# EAGLE schematic Negibus (EAGLE 6.6.0)

## Sheet 1 of 4
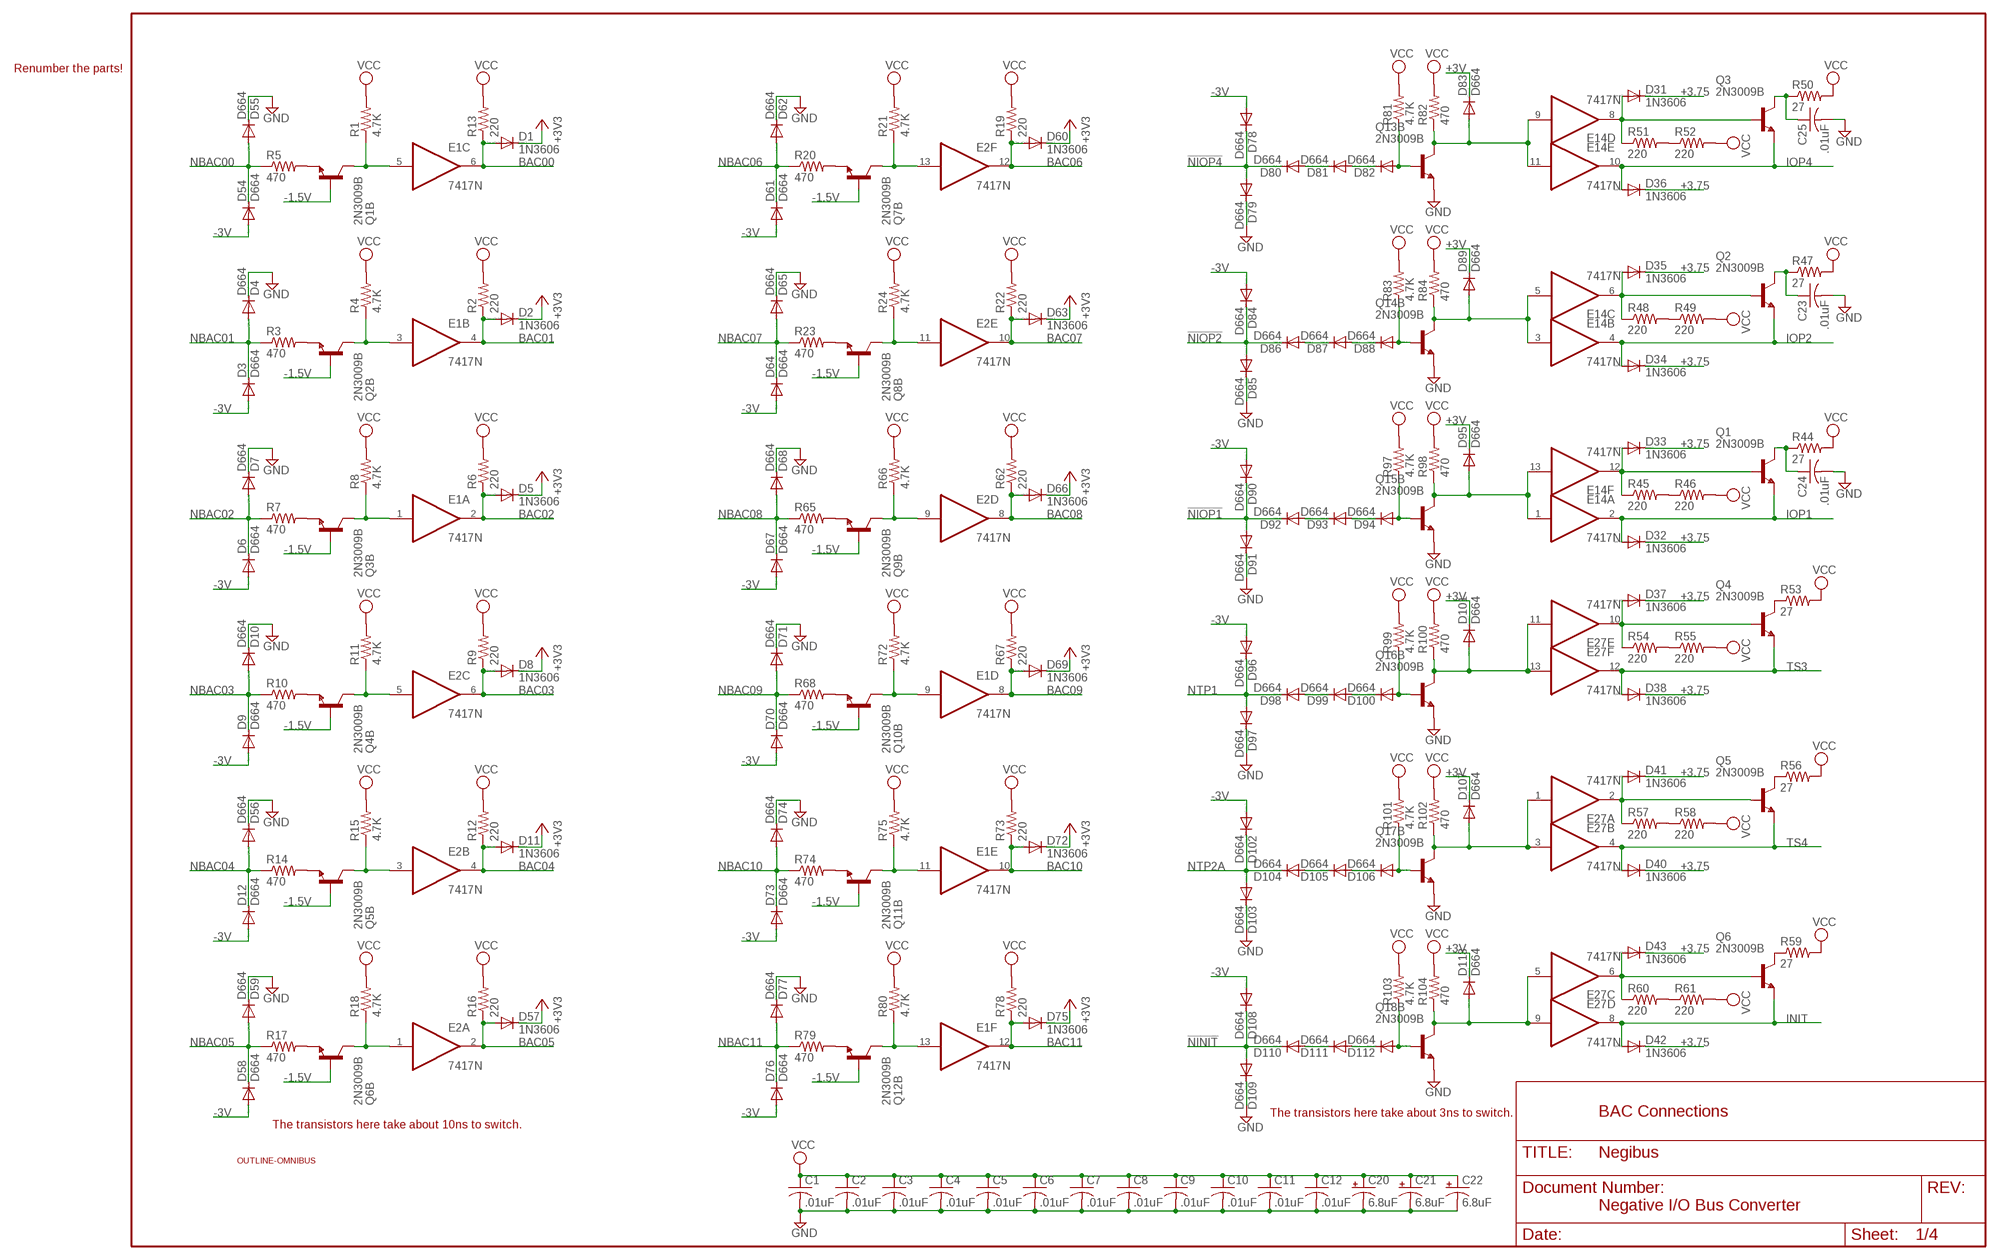
[diagram p0: schematic, sheet 1]

### Parts
C1  .01uF  C-US050-025X075  [C050-025X075]
C2  .01uF  C-US050-025X075  [C050-025X075]
C3  .01uF  C-US050-025X075  [C050-025X075]
C4  .01uF  C-US050-025X075  [C050-025X075]
C5  .01uF  C-US050-025X075  [C050-025X075]
C6  .01uF  C-US050-025X075  [C050-025X075]
C7  .01uF  C-US050-025X075  [C050-025X075]
C8  .01uF  C-US050-025X075  [C050-025X075]
C9  .01uF  C-US050-025X075  [C050-025X075]
C10  .01uF  C-US050-025X075  [C050-025X075]
C11  .01uF  C-US050-025X075  [C050-025X075]
C12  .01uF  C-US050-025X075  [C050-025X075]
C20  6.8uF  CPOL-USE20-8AXIAL  [E12-8]
C21  6.8uF  CPOL-USE20-8AXIAL  [E12-8]
C22  6.8uF  CPOL-USE20-8AXIAL  [E12-8]
C23  .01uF  C-US050-025X075  [C050-025X075]
C24  .01uF  C-US050-025X075  [C050-025X075]
C25  .01uF  C-US050-025X075  [C050-025X075]
D1  1N3606  DIODE-DO35-10  [DO35-10]
D2  1N3606  DIODE-DO35-10  [DO35-10]
D3  D664  1N4148DO35-10  [DO35-10]
D4  D664  1N4148DO35-10  [DO35-10]
D5  1N3606  DIODE-DO35-10  [DO35-10]
D6  D664  1N4148DO35-10  [DO35-10]
D7  D664  1N4148DO35-10  [DO35-10]
D8  1N3606  DIODE-DO35-10  [DO35-10]
D9  D664  1N4148DO35-10  [DO35-10]
D10  D664  1N4148DO35-10  [DO35-10]
D11  1N3606  DIODE-DO35-10  [DO35-10]
D12  D664  1N4148DO35-10  [DO35-10]
D31  1N3606  DIODE-DO35-10  [DO35-10]
D32  1N3606  DIODE-DO35-10  [DO35-10]
D33  1N3606  DIODE-DO35-10  [DO35-10]
D34  1N3606  DIODE-DO35-10  [DO35-10]
D35  1N3606  DIODE-DO35-10  [DO35-10]
D36  1N3606  DIODE-DO35-10  [DO35-10]
D37  1N3606  DIODE-DO35-10  [DO35-10]
D38  1N3606  DIODE-DO35-10  [DO35-10]
D40  1N3606  DIODE-DO35-10  [DO35-10]
D41  1N3606  DIODE-DO35-10  [DO35-10]
D42  1N3606  DIODE-DO35-10  [DO35-10]
D43  1N3606  DIODE-DO35-10  [DO35-10]
D54  D664  1N4148DO35-10  [DO35-10]
D55  D664  1N4148DO35-10  [DO35-10]
D56  D664  1N4148DO35-10  [DO35-10]
D57  1N3606  DIODE-DO35-10  [DO35-10]
D58  D664  1N4148DO35-10  [DO35-10]
D59  D664  1N4148DO35-10  [DO35-10]
D60  1N3606  DIODE-DO35-10  [DO35-10]
D61  D664  1N4148DO35-10  [DO35-10]
D62  D664  1N4148DO35-10  [DO35-10]
D63  1N3606  DIODE-DO35-10  [DO35-10]
D64  D664  1N4148DO35-10  [DO35-10]
D65  D664  1N4148DO35-10  [DO35-10]
D66  1N3606  DIODE-DO35-10  [DO35-10]
D67  D664  1N4148DO35-10  [DO35-10]
D68  D664  1N4148DO35-10  [DO35-10]
D69  1N3606  DIODE-DO35-10  [DO35-10]
D70  D664  1N4148DO35-10  [DO35-10]
D71  D664  1N4148DO35-10  [DO35-10]
D72  1N3606  DIODE-DO35-10  [DO35-10]
D73  D664  1N4148DO35-10  [DO35-10]
D74  D664  1N4148DO35-10  [DO35-10]
D75  1N3606  DIODE-DO35-10  [DO35-10]
D76  D664  1N4148DO35-10  [DO35-10]
D77  D664  1N4148DO35-10  [DO35-10]
D78  D664  1N4148DO35-10  [DO35-10]
D79  D664  1N4148DO35-10  [DO35-10]
D80  D664  1N4148DO35-10  [DO35-10]
D81  D664  1N4148DO35-10  [DO35-10]
D82  D664  1N4148DO35-10  [DO35-10]
D83  D664  1N4148DO35-10  [DO35-10]
D84  D664  1N4148DO35-10  [DO35-10]
D85  D664  1N4148DO35-10  [DO35-10]
D86  D664  1N4148DO35-10  [DO35-10]
D87  D664  1N4148DO35-10  [DO35-10]
D88  D664  1N4148DO35-10  [DO35-10]
D89  D664  1N4148DO35-10  [DO35-10]
D90  D664  1N4148DO35-10  [DO35-10]
D91  D664  1N4148DO35-10  [DO35-10]
D92  D664  1N4148DO35-10  [DO35-10]
D93  D664  1N4148DO35-10  [DO35-10]
D94  D664  1N4148DO35-10  [DO35-10]
D95  D664  1N4148DO35-10  [DO35-10]
D96  D664  1N4148DO35-10  [DO35-10]
D97  D664  1N4148DO35-10  [DO35-10]
D98  D664  1N4148DO35-10  [DO35-10]
D99  D664  1N4148DO35-10  [DO35-10]
D100  D664  1N4148DO35-10  [DO35-10]
D101  D664  1N4148DO35-10  [DO35-10]
D102  D664  1N4148DO35-10  [DO35-10]
D103  D664  1N4148DO35-10  [DO35-10]
D104  D664  1N4148DO35-10  [DO35-10]
D105  D664  1N4148DO35-10  [DO35-10]
D106  D664  1N4148DO35-10  [DO35-10]
D107  D664  1N4148DO35-10  [DO35-10]
D108  D664  1N4148DO35-10  [DO35-10]
D109  D664  1N4148DO35-10  [DO35-10]
D110  D664  1N4148DO35-10  [DO35-10]
D111  D664  1N4148DO35-10  [DO35-10]
D112  D664  1N4148DO35-10  [DO35-10]
D113  D664  1N4148DO35-10  [DO35-10]
E1  7417N  7407N  [DIL14]
E2  7417N  7407N  [DIL14]
E14  7417N  7407N  [DIL14]
E27  7417N  7407N  [DIL14]
Q1  2N3009B  -NPN-TO5  [TO5]
Q1B  2N3009B  2N3019  [TO39]
Q2  2N3009B  -NPN-TO5  [TO5]
Q2B  2N3009B  2N3019  [TO39]
Q3  2N3009B  -NPN-TO5  [TO5]
Q3B  2N3009B  2N3019  [TO39]
Q4  2N3009B  -NPN-TO5  [TO5]
Q4B  2N3009B  2N3019  [TO39]
Q5  2N3009B  -NPN-TO5  [TO5]
Q5B  2N3009B  2N3019  [TO39]
Q6  2N3009B  -NPN-TO5  [TO5]
Q6B  2N3009B  2N3019  [TO39]
Q7B  2N3009B  2N3019  [TO39]
Q8B  2N3009B  2N3019  [TO39]
Q9B  2N3009B  2N3019  [TO39]
Q10B  2N3009B  2N3019  [TO39]
Q11B  2N3009B  2N3019  [TO39]
Q12B  2N3009B  2N3019  [TO39]
Q13B  2N3009B  2N3019  [TO39]
Q14B  2N3009B  2N3019  [TO39]
Q15B  2N3009B  2N3019  [TO39]
Q16B  2N3009B  2N3019  [TO39]
Q17B  2N3009B  2N3019  [TO39]
Q18B  2N3009B  2N3019  [TO39]
R1  4.7K  R-US_0207/10  [0207/10]
R2  220  R-US_0207/10  [0207/10]
R3  470  R-US_0207/10  [0207/10]
R4  4.7K  R-US_0207/10  [0207/10]
R5  470  R-US_0207/10  [0207/10]
R6  220  R-US_0207/10  [0207/10]
R7  470  R-US_0207/10  [0207/10]
R8  4.7K  R-US_0207/10  [0207/10]
R9  220  R-US_0207/10  [0207/10]
R10  470  R-US_0207/10  [0207/10]
R11  4.7K  R-US_0207/10  [0207/10]
R12  220  R-US_0207/10  [0207/10]
R13  220  R-US_0207/10  [0207/10]
R14  470  R-US_0207/10  [0207/10]
R15  4.7K  R-US_0207/10  [0207/10]
R16  220  R-US_0207/10  [0207/10]
R17  470  R-US_0207/10  [0207/10]
R18  4.7K  R-US_0207/10  [0207/10]
R19  220  R-US_0207/10  [0207/10]
R20  470  R-US_0207/10  [0207/10]
R21  4.7K  R-US_0207/10  [0207/10]
R22  220  R-US_0207/10  [0207/10]
R23  470  R-US_0207/10  [0207/10]
R24  4.7K  R-US_0207/10  [0207/10]
R44  27  R-US_0411/12  [0411/12]
R45  220  R-US_0207/10  [0207/10]
R46  220  R-US_0207/10  [0207/10]
R47  27  R-US_0411/12  [0411/12]
R48  220  R-US_0207/10  [0207/10]
R49  220  R-US_0207/10  [0207/10]
R50  27  R-US_0411/12  [0411/12]
R51  220  R-US_0207/10  [0207/10]
R52  220  R-US_0207/10  [0207/10]
R53  27  R-US_0411/12  [0411/12]
R54  220  R-US_0207/10  [0207/10]
R55  220  R-US_0207/10  [0207/10]
R56  27  R-US_0411/12  [0411/12]
R57  220  R-US_0207/10  [0207/10]
R58  220  R-US_0207/10  [0207/10]
R59  27  R-US_0411/12  [0411/12]
R60  220  R-US_0207/10  [0207/10]
R61  220  R-US_0207/10  [0207/10]
R62  220  R-US_0207/10  [0207/10]
R65  470  R-US_0207/10  [0207/10]
R66  4.7K  R-US_0207/10  [0207/10]
R67  220  R-US_0207/10  [0207/10]
R68  470  R-US_0207/10  [0207/10]
R72  4.7K  R-US_0207/10  [0207/10]
R73  220  R-US_0207/10  [0207/10]
R74  470  R-US_0207/10  [0207/10]
R75  4.7K  R-US_0207/10  [0207/10]
R78  220  R-US_0207/10  [0207/10]
R79  470  R-US_0207/10  [0207/10]
R80  4.7K  R-US_0207/10  [0207/10]
R81  4.7K  R-US_0207/10  [0207/10]
R82  470  R-US_0207/10  [0207/10]
R83  4.7K  R-US_0207/10  [0207/10]
R84  470  R-US_0207/10  [0207/10]
R97  4.7K  R-US_0207/10  [0207/10]
R98  470  R-US_0207/10  [0207/10]
R99  4.7K  R-US_0207/10  [0207/10]
R100  470  R-US_0207/10  [0207/10]
R101  4.7K  R-US_0207/10  [0207/10]
R102  470  R-US_0207/10  [0207/10]
R103  4.7K  R-US_0207/10  [0207/10]
R104  470  R-US_0207/10  [0207/10]
U$1  OUTLINE-OMNIBUS  [OMNIBUS]

### Nets
!NINIT: D108.C D109.A D110.C ; also sheet 4
!NIOP1: D90.C D91.A D92.C ; also sheet 4
!NIOP2: D84.C D85.A D86.C ; also sheet 4
!NIOP4: D78.C D79.A D80.C ; also sheet 4
+3.75: D31.C D32.C D33.C D34.C D35.C D36.C D37.C D38.C D40.C D41.C D42.C D43.C ; also sheet 2
+3V [power]: D83.C D89.C D95.C D101.C D107.C D113.C
+3V3: D1.C D2.C D5.C D8.C D11.C D57.C D60.C D63.C D66.C D69.C D72.C D75.C ; also sheet 2
-1.5V [power]: Q1B.2(B) Q2B.2(B) Q3B.2(B) Q4B.2(B) Q5B.2(B) Q6B.2(B) Q7B.2(B) Q8B.2(B) Q9B.2(B) Q10B.2(B) Q11B.2(B) Q12B.2(B) ; also sheet 2
-3V [power]: D3.A D6.A D9.A D12.A D54.A D58.A D61.A D64.A D67.A D70.A D73.A D76.A D78.A D84.A D90.A D96.A D102.A D108.A ; also sheet 2,3
BAC00: D1.A E1.6(C:O) R13.1 ; also sheet 4
BAC01: D2.A E1.4(B:O) R2.1 ; also sheet 4
BAC02: D5.A E1.2(A:O) R6.1 ; also sheet 4
BAC03: D8.A E2.6(C:O) R9.1 ; also sheet 4
BAC04: D11.A E2.4(B:O) R12.1 ; also sheet 4
BAC05: D57.A E2.2(A:O) R16.1 ; also sheet 4
BAC06: D60.A E2.12(F:O) R19.1 ; also sheet 4
BAC07: D63.A E2.10(E:O) R22.1 ; also sheet 4
BAC08: D66.A E2.8(D:O) R62.1 ; also sheet 4
BAC09: D69.A E1.8(D:O) R67.1 ; also sheet 4
BAC10: D72.A E1.10(E:O) R73.1 ; also sheet 4
BAC11: D75.A E1.12(F:O) R78.1 ; also sheet 4
GND: C1.2 C2.2 C3.2 C4.2 C5.2 C6.2 C7.2 C8.2 C9.2 C10.2 C11.2 C12.2 C20.- C21.- C22.- C23.2 C24.2 C25.2 D4.C D7.C D10.C D55.C D56.C D59.C D62.C D65.C D68.C D71.C D74.C D77.C D79.C D85.C D91.C D97.C D103.C D109.C Q13B.1(E) Q14B.1(E) Q15B.1(E) Q16B.1(E) Q17B.1(E) Q18B.1(E) ; also sheet 2,3,4
INIT: D42.A E27.8(D:O) Q6.1(E) ; also sheet 4
IOP1: D32.A E14.2(A:O) Q1.1(E) ; also sheet 4
IOP2: D34.A E14.4(B:O) Q2.1(E) ; also sheet 4
IOP4: D36.A E14.10(E:O) Q3.1(E) ; also sheet 4
N$1: Q2B.1(E) R3.2
N$5: D89.A E14.3(B:I) E14.5(C:I) Q14B.3(C) R84.1
N$8: Q1B.1(E) R5.2
N$9: E1.5(C:I) Q1B.3(C) R1.1
N$10: E1.3(B:I) Q2B.3(C) R4.1
N$11: Q3B.1(E) R7.2
N$12: E1.1(A:I) Q3B.3(C) R8.1
N$13: Q4B.1(E) R10.2
N$14: E2.5(C:I) Q4B.3(C) R11.1
N$15: Q5B.1(E) R14.2
N$16: E2.3(B:I) Q5B.3(C) R15.1
N$17: Q6B.1(E) R17.2
N$18: E2.1(A:I) Q6B.3(C) R18.1
N$19: Q7B.1(E) R20.2
N$20: E2.13(F:I) Q7B.3(C) R21.1
N$21: Q8B.1(E) R23.2
N$22: E2.11(E:I) Q8B.3(C) R24.1
N$23: Q9B.1(E) R65.2
N$24: E2.9(D:I) Q9B.3(C) R66.1
N$25: Q10B.1(E) R68.2
N$26: E1.9(D:I) Q10B.3(C) R72.1
N$27: Q11B.1(E) R74.2
N$28: E1.11(E:I) Q11B.3(C) R75.1
N$29: Q12B.1(E) R79.2
N$30: E1.13(F:I) Q12B.3(C) R80.1
N$32: D82.A Q13B.2(B) R81.1
N$33: D80.A D81.C
N$35: D88.A Q14B.2(B) R83.1
N$36: D86.A D87.C
N$37: D87.A D88.C
N$47: D94.A Q15B.2(B) R97.1
N$52: R54.2 R55.1
N$53: D92.A D93.C
N$54: D101.A E27.11(E:I) E27.13(F:I) Q16B.3(C) R100.1
N$55: D37.A E27.10(E:O) Q4.2(B) R54.1
N$56: Q4.3(C) R53.1
N$57: D93.A D94.C
N$58: D41.A E27.2(A:O) Q5.2(B) R57.1
N$59: D95.A E14.1(A:I) E14.13(F:I) Q15B.3(C) R98.1
N$60: D107.A E27.1(A:I) E27.3(B:I) Q17B.3(C) R102.1
N$61: R57.2 R58.1
N$63: Q5.3(C) R56.1
N$64: D100.A Q16B.2(B) R99.1
N$65: D98.A D99.C
N$66: D113.A E27.5(C:I) E27.9(D:I) Q18B.3(C) R104.1
N$67: R60.2 R61.1
N$68: D43.A E27.6(C:O) Q6.2(B) R60.1
N$69: Q6.3(C) R59.1
N$70: D99.A D100.C
N$73: D81.A D82.C
N$74: D83.A E14.9(D:I) E14.11(E:I) Q13B.3(C) R82.1
N$75: D106.A Q17B.2(B) R101.1
N$76: D104.A D105.C
N$77: D105.A D106.C
N$80: D112.A Q18B.2(B) R103.1
N$81: D110.A D111.C
N$82: D111.A D112.C
N$108: D35.A E14.6(C:O) Q2.2(B) R48.1
N$109: D33.A E14.12(F:O) Q1.2(B) R45.1
N$110: R48.2 R49.1
N$111: R51.2 R52.1
N$112: D31.A E14.8(D:O) Q3.2(B) R51.1
N$113: C25.1 Q3.3(C) R50.1
N$116: C23.1 Q2.3(C) R47.1
N$118: C24.1 Q1.3(C) R44.1
N$119: R45.2 R46.1
NBAC00: D54.C D55.A R5.1 ; also sheet 4
NBAC01: D3.C D4.A R3.1 ; also sheet 4
NBAC02: D6.C D7.A R7.1 ; also sheet 4
NBAC03: D9.C D10.A R10.1 ; also sheet 4
NBAC04: D12.C D56.A R14.1 ; also sheet 4
NBAC05: D58.C D59.A R17.1 ; also sheet 4
NBAC06: D61.C D62.A R20.1 ; also sheet 4
NBAC07: D64.C D65.A R23.1 ; also sheet 4
NBAC08: D67.C D68.A R65.1 ; also sheet 4
NBAC09: D70.C D71.A R68.1 ; also sheet 4
NBAC10: D73.C D74.A R74.1 ; also sheet 4
NBAC11: D76.C D77.A R79.1 ; also sheet 4
NTP1: D96.C D97.A D98.C ; also sheet 4
NTP2A: D102.C D103.A D104.C ; also sheet 4
TS3: D38.A E27.12(F:O) Q4.1(E) ; also sheet 4
TS4: D40.A E27.4(B:O) Q5.1(E) ; also sheet 4
VCC: C1.1 C2.1 C3.1 C4.1 C5.1 C6.1 C7.1 C8.1 C9.1 C10.1 C11.1 C12.1 C20.+ C21.+ C22.+ R1.2 R2.2 R4.2 R6.2 R8.2 R9.2 R11.2 R12.2 R13.2 R15.2 R16.2 R18.2 R19.2 R21.2 R22.2 R24.2 R44.2 R46.2 R47.2 R49.2 R50.2 R52.2 R53.2 R55.2 R56.2 R58.2 R59.2 R61.2 R62.2 R66.2 R67.2 R72.2 R73.2 R75.2 R78.2 R80.2 R81.2 R82.2 R83.2 R84.2 R97.2 R98.2 R99.2 R100.2 R101.2 R102.2 R103.2 R104.2 ; also sheet 2,3,4

### Notes on the sheet
- Renumber the parts!
- The transistors here take about 3ns to switch. | BAC Connections
- The transistors here take about 10ns to switch.
- Negative I/O Bus Converter

## Sheet 2 of 4
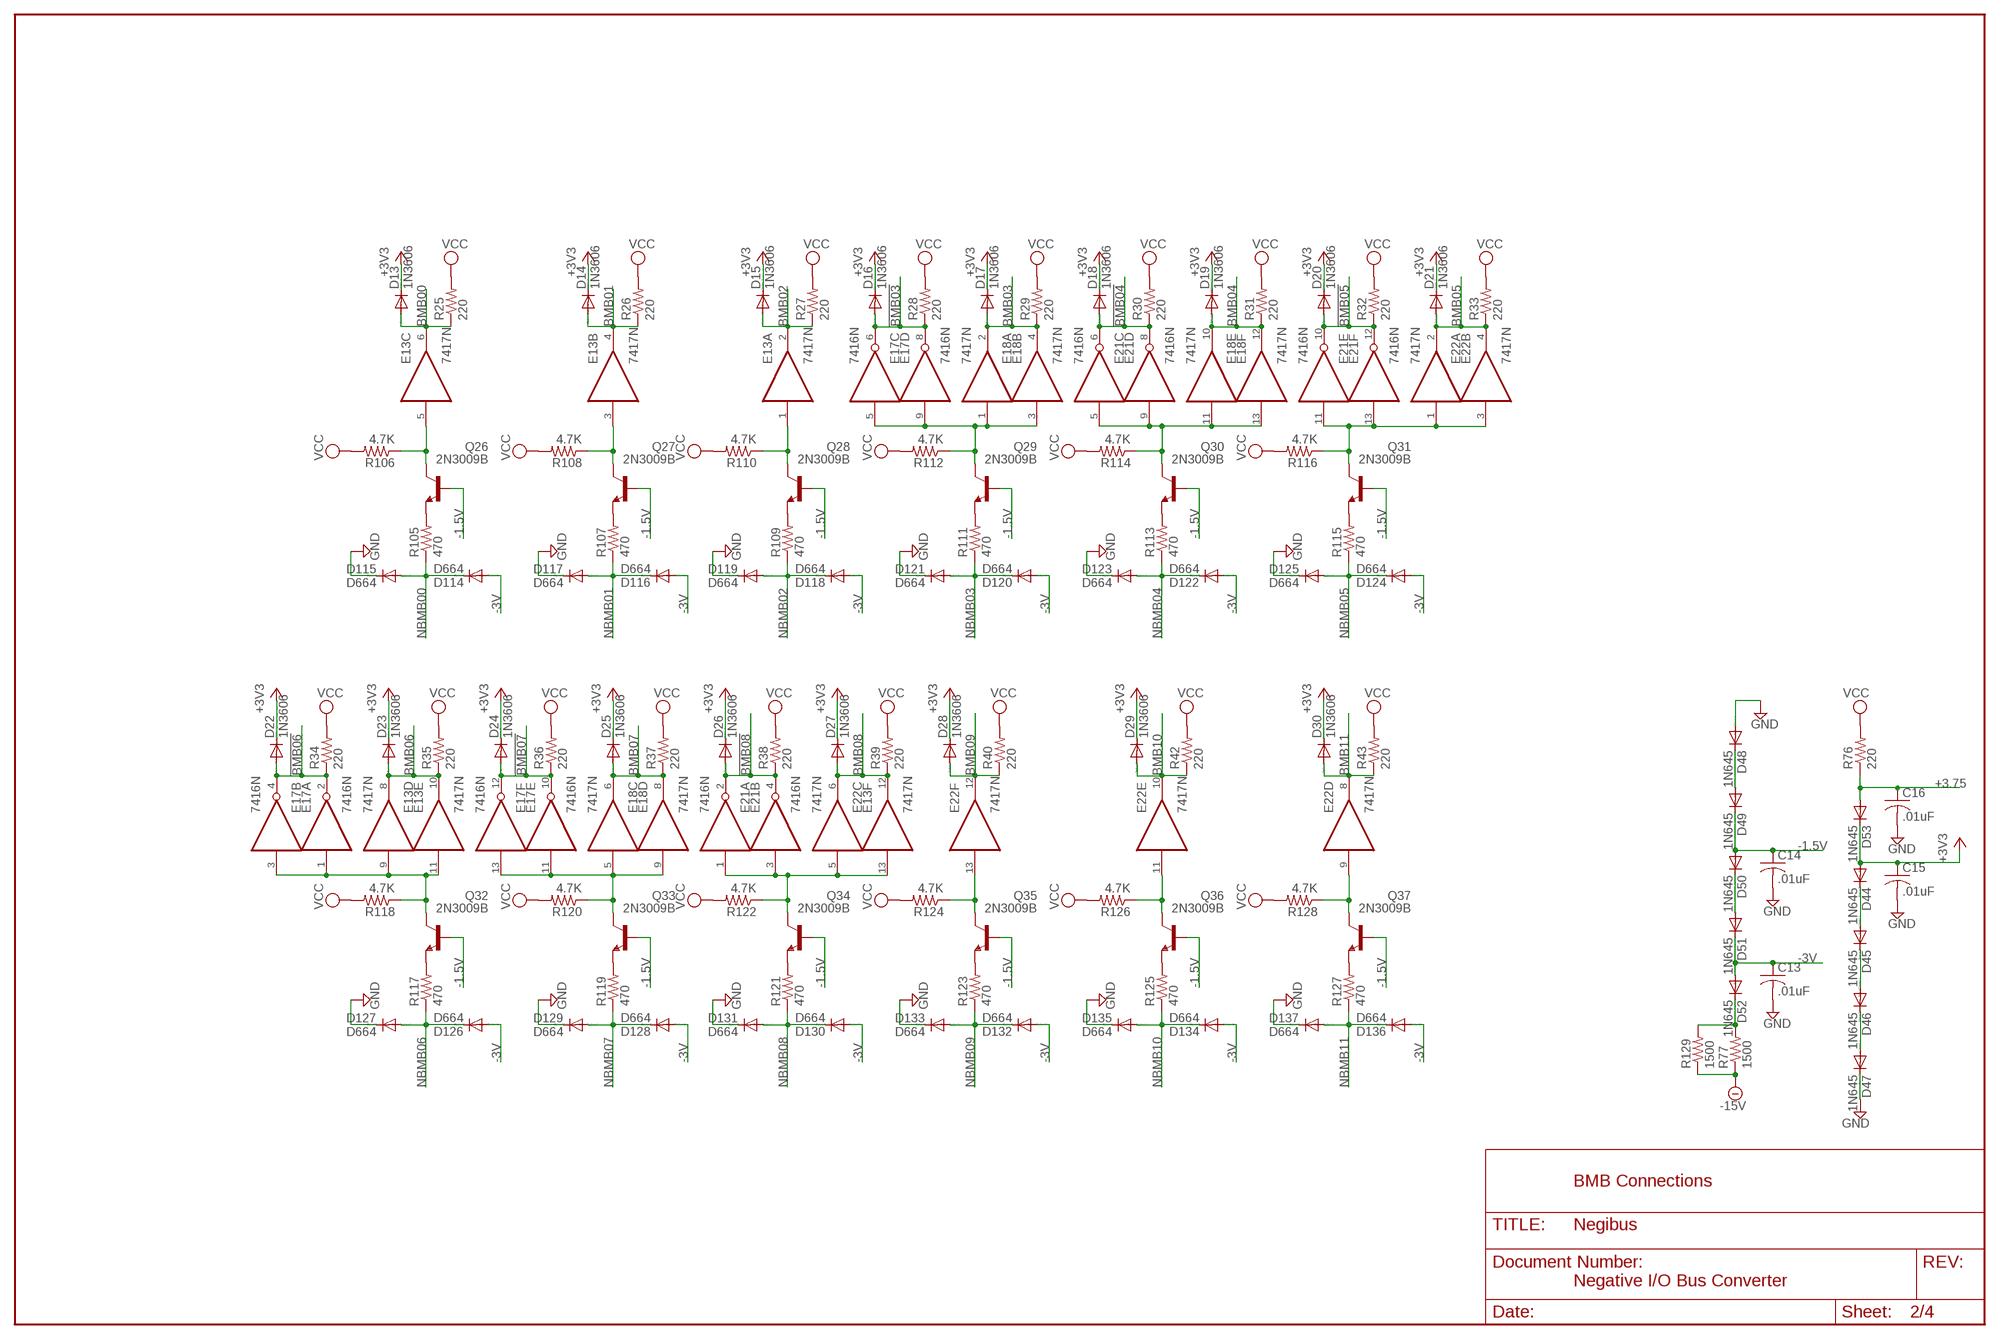
[diagram p1: schematic, sheet 2]

### Parts
C13  .01uF  C-US050-025X075  [C050-025X075]
C14  .01uF  C-US050-025X075  [C050-025X075]
C15  .01uF  C-US050-025X075  [C050-025X075]
C16  .01uF  C-US050-025X075  [C050-025X075]
D13  1N3606  DIODE-DO35-10  [DO35-10]
D14  1N3606  DIODE-DO35-10  [DO35-10]
D15  1N3606  DIODE-DO35-10  [DO35-10]
D16  1N3606  DIODE-DO35-10  [DO35-10]
D17  1N3606  DIODE-DO35-10  [DO35-10]
D18  1N3606  DIODE-DO35-10  [DO35-10]
D19  1N3606  DIODE-DO35-10  [DO35-10]
D20  1N3606  DIODE-DO35-10  [DO35-10]
D21  1N3606  DIODE-DO35-10  [DO35-10]
D22  1N3606  DIODE-DO35-10  [DO35-10]
D23  1N3606  DIODE-DO35-10  [DO35-10]
D24  1N3606  DIODE-DO35-10  [DO35-10]
D25  1N3606  DIODE-DO35-10  [DO35-10]
D26  1N3606  DIODE-DO35-10  [DO35-10]
D27  1N3606  DIODE-DO35-10  [DO35-10]
D28  1N3606  DIODE-DO35-10  [DO35-10]
D29  1N3606  DIODE-DO35-10  [DO35-10]
D30  1N3606  DIODE-DO35-10  [DO35-10]
D44  1N645  DIODE-DO35-10  [DO35-10]
D45  1N645  DIODE-DO35-10  [DO35-10]
D46  1N645  DIODE-DO35-10  [DO35-10]
D47  1N645  DIODE-DO35-10  [DO35-10]
D48  1N645  DIODE-DO35-10  [DO35-10]
D49  1N645  DIODE-DO35-10  [DO35-10]
D50  1N645  DIODE-DO35-10  [DO35-10]
D51  1N645  DIODE-DO35-10  [DO35-10]
D52  1N645  DIODE-DO35-10  [DO35-10]
D53  1N645  DIODE-DO35-10  [DO35-10]
D114  D664  1N4148DO35-10  [DO35-10]
D115  D664  1N4148DO35-10  [DO35-10]
D116  D664  1N4148DO35-10  [DO35-10]
D117  D664  1N4148DO35-10  [DO35-10]
D118  D664  1N4148DO35-10  [DO35-10]
D119  D664  1N4148DO35-10  [DO35-10]
D120  D664  1N4148DO35-10  [DO35-10]
D121  D664  1N4148DO35-10  [DO35-10]
D122  D664  1N4148DO35-10  [DO35-10]
D123  D664  1N4148DO35-10  [DO35-10]
D124  D664  1N4148DO35-10  [DO35-10]
D125  D664  1N4148DO35-10  [DO35-10]
D126  D664  1N4148DO35-10  [DO35-10]
D127  D664  1N4148DO35-10  [DO35-10]
D128  D664  1N4148DO35-10  [DO35-10]
D129  D664  1N4148DO35-10  [DO35-10]
D130  D664  1N4148DO35-10  [DO35-10]
D131  D664  1N4148DO35-10  [DO35-10]
D132  D664  1N4148DO35-10  [DO35-10]
D133  D664  1N4148DO35-10  [DO35-10]
D134  D664  1N4148DO35-10  [DO35-10]
D135  D664  1N4148DO35-10  [DO35-10]
D136  D664  1N4148DO35-10  [DO35-10]
D137  D664  1N4148DO35-10  [DO35-10]
E13  7417N  7407N  [DIL14]
E17  7416N  [DIL14]
E18  7417N  7407N  [DIL14]
E21  7416N  [DIL14]
E22  7417N  7407N  [DIL14]
Q26  2N3009B  2N3019  [TO39]
Q27  2N3009B  2N3019  [TO39]
Q28  2N3009B  2N3019  [TO39]
Q29  2N3009B  2N3019  [TO39]
Q30  2N3009B  2N3019  [TO39]
Q31  2N3009B  2N3019  [TO39]
Q32  2N3009B  2N3019  [TO39]
Q33  2N3009B  2N3019  [TO39]
Q34  2N3009B  2N3019  [TO39]
Q35  2N3009B  2N3019  [TO39]
Q36  2N3009B  2N3019  [TO39]
Q37  2N3009B  2N3019  [TO39]
R25  220  R-US_0207/10  [0207/10]
R26  220  R-US_0207/10  [0207/10]
R27  220  R-US_0207/10  [0207/10]
R28  220  R-US_0207/10  [0207/10]
R29  220  R-US_0207/10  [0207/10]
R30  220  R-US_0207/10  [0207/10]
R31  220  R-US_0207/10  [0207/10]
R32  220  R-US_0207/10  [0207/10]
R33  220  R-US_0207/10  [0207/10]
R34  220  R-US_0207/10  [0207/10]
R35  220  R-US_0207/10  [0207/10]
R36  220  R-US_0207/10  [0207/10]
R37  220  R-US_0207/10  [0207/10]
R38  220  R-US_0207/10  [0207/10]
R39  220  R-US_0207/10  [0207/10]
R40  220  R-US_0207/10  [0207/10]
R42  220  R-US_0207/10  [0207/10]
R43  220  R-US_0207/10  [0207/10]
R76  220  R-US_0207/10  [0207/10]
R77  1500  R-US_0207/10  [0207/10]
R105  470  R-US_0207/10  [0207/10]
R106  4.7K  R-US_0207/10  [0207/10]
R107  470  R-US_0207/10  [0207/10]
R108  4.7K  R-US_0207/10  [0207/10]
R109  470  R-US_0207/10  [0207/10]
R110  4.7K  R-US_0207/10  [0207/10]
R111  470  R-US_0207/10  [0207/10]
R112  4.7K  R-US_0207/10  [0207/10]
R113  470  R-US_0207/10  [0207/10]
R114  4.7K  R-US_0207/10  [0207/10]
R115  470  R-US_0207/10  [0207/10]
R116  4.7K  R-US_0207/10  [0207/10]
R117  470  R-US_0207/10  [0207/10]
R118  4.7K  R-US_0207/10  [0207/10]
R119  470  R-US_0207/10  [0207/10]
R120  4.7K  R-US_0207/10  [0207/10]
R121  470  R-US_0207/10  [0207/10]
R122  4.7K  R-US_0207/10  [0207/10]
R123  470  R-US_0207/10  [0207/10]
R124  4.7K  R-US_0207/10  [0207/10]
R125  470  R-US_0207/10  [0207/10]
R126  4.7K  R-US_0207/10  [0207/10]
R127  470  R-US_0207/10  [0207/10]
R128  4.7K  R-US_0207/10  [0207/10]
R129  1500  R-US_0207/10  [0207/10]

### Nets
!BMB03: D16.A E17.6(C:O) E17.8(D:O) R28.1 ; also sheet 4
!BMB04: D18.A E21.6(C:O) E21.8(D:O) R30.1 ; also sheet 4
!BMB05: D20.A E21.10(E:O) E21.12(F:O) R32.1 ; also sheet 4
!BMB06: D22.A E17.2(A:O) E17.4(B:O) R34.1 ; also sheet 4
!BMB07: D24.A E17.10(E:O) E17.12(F:O) R36.1 ; also sheet 4
!BMB08: D26.A E21.2(A:O) E21.4(B:O) R38.1 ; also sheet 4
+3.75: C16.1 D53.A R76.1 ; also sheet 1
+3V3: C15.1 D13.C D14.C D15.C D16.C D17.C D18.C D19.C D20.C D21.C D22.C D23.C D24.C D25.C D26.C D27.C D28.C D29.C D30.C D44.A D53.C ; also sheet 1
-1.5V [power]: C14.1 D49.C D50.A Q26.2(B) Q27.2(B) Q28.2(B) Q29.2(B) Q30.2(B) Q31.2(B) Q32.2(B) Q33.2(B) Q34.2(B) Q35.2(B) Q36.2(B) Q37.2(B) ; also sheet 1
-3V [power]: C13.1 D51.C D52.A D114.A D116.A D118.A D120.A D122.A D124.A D126.A D128.A D130.A D132.A D134.A D136.A ; also sheet 1,3
-15V: R77.1 R129.1 ; also sheet 3,4
BMB00: D13.A E13.6(C:O) R25.1 ; also sheet 4
BMB01: D14.A E13.4(B:O) R26.1 ; also sheet 4
BMB02: D15.A E13.2(A:O) R27.1 ; also sheet 4
BMB03: D17.A E18.2(A:O) E18.4(B:O) R29.1 ; also sheet 4
BMB04: D19.A E18.10(E:O) E18.12(F:O) R31.1 ; also sheet 4
BMB05: D21.A E22.2(A:O) E22.4(B:O) R33.1 ; also sheet 4
BMB06: D23.A E13.8(D:O) E13.10(E:O) R35.1 ; also sheet 4
BMB07: D25.A E18.6(C:O) E18.8(D:O) R37.1 ; also sheet 4
BMB08: D27.A E13.12(F:O) E22.6(C:O) R39.1 ; also sheet 4
BMB09: D28.A E22.12(F:O) R40.1 ; also sheet 4
BMB10: D29.A E22.10(E:O) R42.1 ; also sheet 4
BMB11: D30.A E22.8(D:O) R43.1 ; also sheet 4
GND: C13.2 C14.2 C15.2 C16.2 D47.C D48.A D115.C D117.C D119.C D121.C D123.C D125.C D127.C D129.C D131.C D133.C D135.C D137.C ; also sheet 1,3,4
N$2: Q26.1(E) R105.2
N$3: E13.5(C:I) Q26.3(C) R106.1
N$4: Q27.1(E) R107.2
N$6: E18.11(E:I) E18.13(F:I) E21.5(C:I) E21.9(D:I) Q30.3(C) R114.1
N$31: D52.C R77.2 R129.2
N$34: E13.3(B:I) Q27.3(C) R108.1
N$38: Q28.1(E) R109.2
N$39: E13.1(A:I) Q28.3(C) R110.1
N$40: Q29.1(E) R111.2
N$41: E21.11(E:I) E21.13(F:I) E22.1(A:I) E22.3(B:I) Q31.3(C) R116.1
N$43: E17.11(E:I) E17.13(F:I) E18.5(C:I) E18.9(D:I) Q33.3(C) R120.1
N$44: E13.13(F:I) E21.1(A:I) E21.3(B:I) E22.5(C:I) Q34.3(C) R122.1
N$45: E17.5(C:I) E17.9(D:I) E18.1(A:I) E18.3(B:I) Q29.3(C) R112.1
N$46: E13.9(D:I) E13.11(E:I) E17.1(A:I) E17.3(B:I) Q32.3(C) R118.1
N$48: Q30.1(E) R113.2
N$49: E22.11(E:I) Q36.3(C) R126.1
N$50: E22.9(D:I) Q37.3(C) R128.1
N$51: Q31.1(E) R115.2
N$62: Q32.1(E) R117.2
N$72: Q33.1(E) R119.2
N$79: Q34.1(E) R121.2
N$84: Q35.1(E) R123.2
N$85: Q36.1(E) R125.2
N$86: Q37.1(E) R127.2
N$87: E22.13(F:I) Q35.3(C) R124.1
N$100: D44.C D45.A
N$101: D45.C D46.A
N$102: D46.C D47.A
N$104: D48.C D49.A
N$106: D50.C D51.A
NBMB00: D114.C D115.A R105.1 ; also sheet 4
NBMB01: D116.C D117.A R107.1 ; also sheet 4
NBMB02: D118.C D119.A R109.1 ; also sheet 4
NBMB03: D120.C D121.A R111.1 ; also sheet 4
NBMB04: D122.C D123.A R113.1 ; also sheet 4
NBMB05: D124.C D125.A R115.1 ; also sheet 4
NBMB06: D126.C D127.A R117.1 ; also sheet 4
NBMB07: D128.C D129.A R119.1 ; also sheet 4
NBMB08: D130.C D131.A R121.1 ; also sheet 4
NBMB09: D132.C D133.A R123.1 ; also sheet 4
NBMB10: D134.C D135.A R125.1 ; also sheet 4
NBMB11: D136.C D137.A R127.1 ; also sheet 4
VCC: R25.2 R26.2 R27.2 R28.2 R29.2 R30.2 R31.2 R32.2 R33.2 R34.2 R35.2 R36.2 R37.2 R38.2 R39.2 R40.2 R42.2 R43.2 R76.2 R106.2 R108.2 R110.2 R112.2 R114.2 R116.2 R118.2 R120.2 R122.2 R124.2 R126.2 R128.2 ; also sheet 1,3,4

### Notes on the sheet
- BMB Connections
- Negative I/O Bus Converter

## Sheet 3 of 4
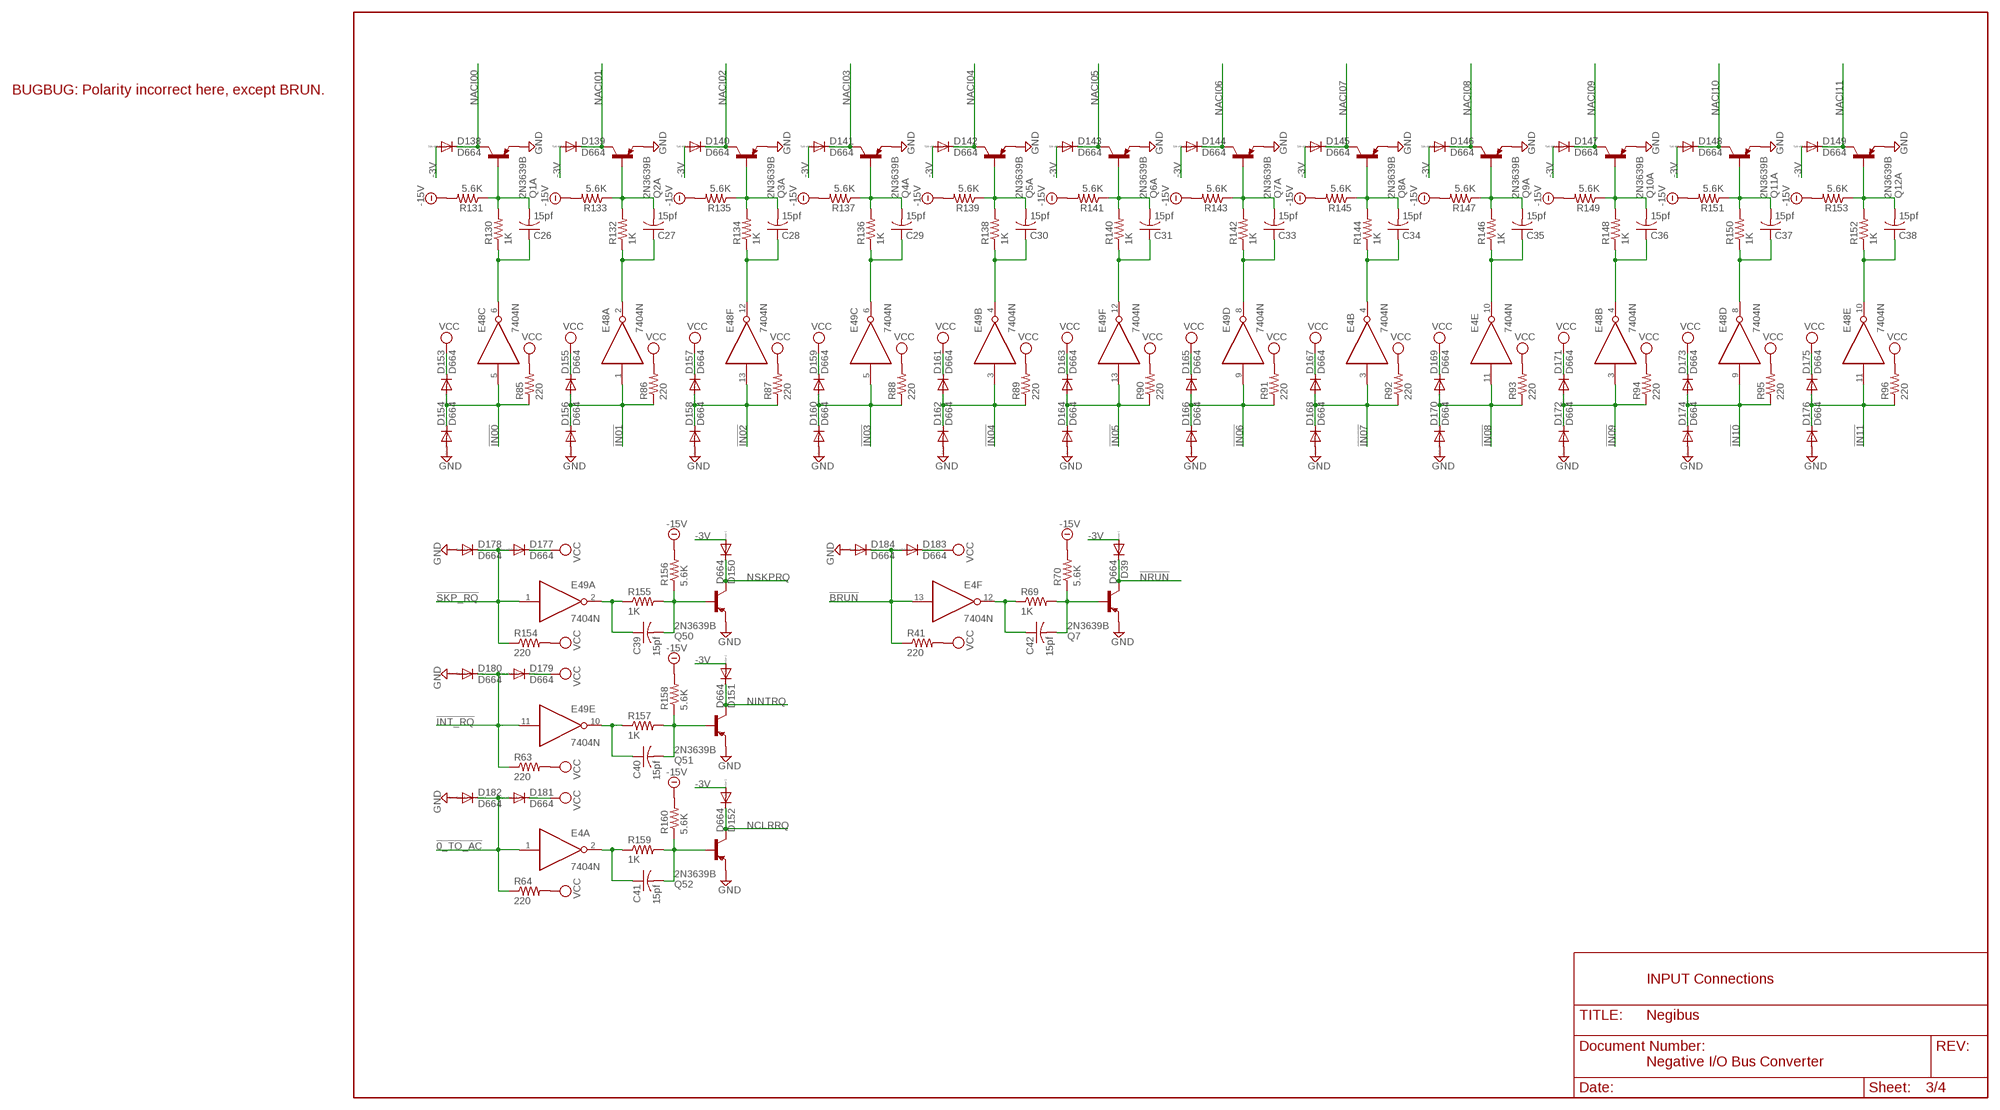
[diagram p2: schematic, sheet 3]

### Parts
C26  15pf  C-US050-025X075  [C050-025X075]
C27  15pf  C-US050-025X075  [C050-025X075]
C28  15pf  C-US050-025X075  [C050-025X075]
C29  15pf  C-US050-025X075  [C050-025X075]
C30  15pf  C-US050-025X075  [C050-025X075]
C31  15pf  C-US050-025X075  [C050-025X075]
C33  15pf  C-US050-025X075  [C050-025X075]
C34  15pf  C-US050-025X075  [C050-025X075]
C35  15pf  C-US050-025X075  [C050-025X075]
C36  15pf  C-US050-025X075  [C050-025X075]
C37  15pf  C-US050-025X075  [C050-025X075]
C38  15pf  C-US050-025X075  [C050-025X075]
C39  15pf  C-US050-025X075  [C050-025X075]
C40  15pf  C-US050-025X075  [C050-025X075]
C41  15pf  C-US050-025X075  [C050-025X075]
C42  15pf  C-US050-025X075  [C050-025X075]
D39  D664  1N4148DO35-10  [DO35-10]
D138  D664  1N4148DO35-10  [DO35-10]
D139  D664  1N4148DO35-10  [DO35-10]
D140  D664  1N4148DO35-10  [DO35-10]
D141  D664  1N4148DO35-10  [DO35-10]
D142  D664  1N4148DO35-10  [DO35-10]
D143  D664  1N4148DO35-10  [DO35-10]
D144  D664  1N4148DO35-10  [DO35-10]
D145  D664  1N4148DO35-10  [DO35-10]
D146  D664  1N4148DO35-10  [DO35-10]
D147  D664  1N4148DO35-10  [DO35-10]
D148  D664  1N4148DO35-10  [DO35-10]
D149  D664  1N4148DO35-10  [DO35-10]
D150  D664  1N4148DO35-10  [DO35-10]
D151  D664  1N4148DO35-10  [DO35-10]
D152  D664  1N4148DO35-10  [DO35-10]
D153  D664  1N4148DO35-10  [DO35-10]
D154  D664  1N4148DO35-10  [DO35-10]
D155  D664  1N4148DO35-10  [DO35-10]
D156  D664  1N4148DO35-10  [DO35-10]
D157  D664  1N4148DO35-10  [DO35-10]
D158  D664  1N4148DO35-10  [DO35-10]
D159  D664  1N4148DO35-10  [DO35-10]
D160  D664  1N4148DO35-10  [DO35-10]
D161  D664  1N4148DO35-10  [DO35-10]
D162  D664  1N4148DO35-10  [DO35-10]
D163  D664  1N4148DO35-10  [DO35-10]
D164  D664  1N4148DO35-10  [DO35-10]
D165  D664  1N4148DO35-10  [DO35-10]
D166  D664  1N4148DO35-10  [DO35-10]
D167  D664  1N4148DO35-10  [DO35-10]
D168  D664  1N4148DO35-10  [DO35-10]
D169  D664  1N4148DO35-10  [DO35-10]
D170  D664  1N4148DO35-10  [DO35-10]
D171  D664  1N4148DO35-10  [DO35-10]
D172  D664  1N4148DO35-10  [DO35-10]
D173  D664  1N4148DO35-10  [DO35-10]
D174  D664  1N4148DO35-10  [DO35-10]
D175  D664  1N4148DO35-10  [DO35-10]
D176  D664  1N4148DO35-10  [DO35-10]
D177  D664  1N4148DO35-10  [DO35-10]
D178  D664  1N4148DO35-10  [DO35-10]
D179  D664  1N4148DO35-10  [DO35-10]
D180  D664  1N4148DO35-10  [DO35-10]
D181  D664  1N4148DO35-10  [DO35-10]
D182  D664  1N4148DO35-10  [DO35-10]
D183  D664  1N4148DO35-10  [DO35-10]
D184  D664  1N4148DO35-10  [DO35-10]
E4  7404N  [DIL14]
E48  7404N  [DIL14]
E49  7404N  [DIL14]
Q1A  2N3639B  2N3637  [TO39]
Q2A  2N3639B  2N3637  [TO39]
Q3A  2N3639B  2N3637  [TO39]
Q4A  2N3639B  2N3637  [TO39]
Q5A  2N3639B  2N3637  [TO39]
Q6A  2N3639B  2N3637  [TO39]
Q7  2N3639B  2N3637  [TO39]
Q7A  2N3639B  2N3637  [TO39]
Q8A  2N3639B  2N3637  [TO39]
Q9A  2N3639B  2N3637  [TO39]
Q10A  2N3639B  2N3637  [TO39]
Q11A  2N3639B  2N3637  [TO39]
Q12A  2N3639B  2N3637  [TO39]
Q50  2N3639B  2N3637  [TO39]
Q51  2N3639B  2N3637  [TO39]
Q52  2N3639B  2N3637  [TO39]
R41  220  R-US_0207/10  [0207/10]
R63  220  R-US_0207/10  [0207/10]
R64  220  R-US_0207/10  [0207/10]
R69  1K  R-US_0207/10  [0207/10]
R70  5.6K  R-US_0207/10  [0207/10]
R85  220  R-US_0207/10  [0207/10]
R86  220  R-US_0207/10  [0207/10]
R87  220  R-US_0207/10  [0207/10]
R88  220  R-US_0207/10  [0207/10]
R89  220  R-US_0207/10  [0207/10]
R90  220  R-US_0207/10  [0207/10]
R91  220  R-US_0207/10  [0207/10]
R92  220  R-US_0207/10  [0207/10]
R93  220  R-US_0207/10  [0207/10]
R94  220  R-US_0207/10  [0207/10]
R95  220  R-US_0207/10  [0207/10]
R96  220  R-US_0207/10  [0207/10]
R130  1K  R-US_0207/10  [0207/10]
R131  5.6K  R-US_0207/10  [0207/10]
R132  1K  R-US_0207/10  [0207/10]
R133  5.6K  R-US_0207/10  [0207/10]
R134  1K  R-US_0207/10  [0207/10]
R135  5.6K  R-US_0207/10  [0207/10]
R136  1K  R-US_0207/10  [0207/10]
R137  5.6K  R-US_0207/10  [0207/10]
R138  1K  R-US_0207/10  [0207/10]
R139  5.6K  R-US_0207/10  [0207/10]
R140  1K  R-US_0207/10  [0207/10]
R141  5.6K  R-US_0207/10  [0207/10]
R142  1K  R-US_0207/10  [0207/10]
R143  5.6K  R-US_0207/10  [0207/10]
R144  1K  R-US_0207/10  [0207/10]
R145  5.6K  R-US_0207/10  [0207/10]
R146  1K  R-US_0207/10  [0207/10]
R147  5.6K  R-US_0207/10  [0207/10]
R148  1K  R-US_0207/10  [0207/10]
R149  5.6K  R-US_0207/10  [0207/10]
R150  1K  R-US_0207/10  [0207/10]
R151  5.6K  R-US_0207/10  [0207/10]
R152  1K  R-US_0207/10  [0207/10]
R153  5.6K  R-US_0207/10  [0207/10]
R154  220  R-US_0207/10  [0207/10]
R155  1K  R-US_0207/10  [0207/10]
R156  5.6K  R-US_0207/10  [0207/10]
R157  1K  R-US_0207/10  [0207/10]
R158  5.6K  R-US_0207/10  [0207/10]
R159  1K  R-US_0207/10  [0207/10]
R160  5.6K  R-US_0207/10  [0207/10]

### Nets
!0_TO_AC: D181.A D182.C E4.1(A:I) R64.1 ; also sheet 4
!BRUN: D183.A D184.C E4.13(F:I) R41.1 ; also sheet 4
!IN00: D153.A D154.C E48.5(C:I) R85.1 ; also sheet 4
!IN01: D155.A D156.C E48.1(A:I) R86.1 ; also sheet 4
!IN02: D157.A D158.C E48.13(F:I) R87.1 ; also sheet 4
!IN03: D159.A D160.C E49.5(C:I) R88.1 ; also sheet 4
!IN04: D161.A D162.C E49.3(B:I) R89.1 ; also sheet 4
!IN05: D163.A D164.C E49.13(F:I) R90.1 ; also sheet 4
!IN06: D165.A D166.C E49.9(D:I) R91.1 ; also sheet 4
!IN07: D167.A D168.C E4.3(B:I) R92.1 ; also sheet 4
!IN08: D169.A D170.C E4.11(E:I) R93.1 ; also sheet 4
!IN09: D171.A D172.C E48.3(B:I) R94.1 ; also sheet 4
!IN10: D173.A D174.C E48.9(D:I) R95.1 ; also sheet 4
!IN11: D175.A D176.C E48.11(E:I) R96.1 ; also sheet 4
!INT_RQ: D179.A D180.C E49.11(E:I) R63.1 ; also sheet 4
!NRUN: D39.C Q7.3(C) ; also sheet 4
!SKP_RQ: D177.A D178.C E49.1(A:I) R154.1 ; also sheet 4
-3V [power]: D39.A D138.A D139.A D140.A D141.A D142.A D143.A D144.A D145.A D146.A D147.A D148.A D149.A D150.A D151.A D152.A ; also sheet 1,2
-15V: R70.2 R131.2 R133.2 R135.2 R137.2 R139.2 R141.2 R143.2 R145.2 R147.2 R149.2 R151.2 R153.2 R156.2 R158.2 R160.2 ; also sheet 2,4
GND: D154.A D156.A D158.A D160.A D162.A D164.A D166.A D168.A D170.A D172.A D174.A D176.A D178.A D180.A D182.A D184.A Q1A.1(E) Q2A.1(E) Q3A.1(E) Q4A.1(E) Q5A.1(E) Q6A.1(E) Q7.1(E) Q7A.1(E) Q8A.1(E) Q9A.1(E) Q10A.1(E) Q11A.1(E) Q12A.1(E) Q50.1(E) Q51.1(E) Q52.1(E) ; also sheet 1,2,4
N$7: C26.1 E48.6(C:O) R130.1
N$42: C28.1 E48.12(F:O) R134.1
N$88: C26.2 Q1A.2(B) R130.2 R131.1
N$89: C39.1 E49.2(A:O) R155.1
N$90: C27.1 E48.2(A:O) R132.1
N$91: C39.2 Q50.2(B) R155.2 R156.1
N$92: C27.2 Q2A.2(B) R132.2 R133.1
N$93: C40.1 E49.10(E:O) R157.1
N$94: C40.2 Q51.2(B) R157.2 R158.1
N$95: C28.2 Q3A.2(B) R134.2 R135.1
N$96: C41.1 E4.2(A:O) R159.1
N$97: C29.1 E49.6(C:O) R136.1
N$98: C29.2 Q4A.2(B) R136.2 R137.1
N$99: C41.2 Q52.2(B) R159.2 R160.1
N$103: C30.1 E49.4(B:O) R138.1
N$105: C42.1 E4.12(F:O) R69.1
N$107: C30.2 Q5A.2(B) R138.2 R139.1
N$114: C42.2 Q7.2(B) R69.2 R70.1
N$121: C31.1 E49.12(F:O) R140.1
N$122: C31.2 Q6A.2(B) R140.2 R141.1
N$125: C33.1 E49.8(D:O) R142.1
N$127: C34.1 E4.4(B:O) R144.1
N$129: C35.1 E4.10(E:O) R146.1
N$131: C33.2 Q7A.2(B) R142.2 R143.1
N$132: C38.1 E48.10(E:O) R152.1
N$133: C36.1 E48.4(B:O) R148.1
N$136: C34.2 Q8A.2(B) R144.2 R145.1
N$137: C37.1 E48.8(D:O) R150.1
N$141: C35.2 Q9A.2(B) R146.2 R147.1
N$144: C36.2 Q10A.2(B) R148.2 R149.1
N$147: C37.2 Q11A.2(B) R150.2 R151.1
N$150: C38.2 Q12A.2(B) R152.2 R153.1
NACI00: D138.C Q1A.3(C) ; also sheet 4
NACI01: D139.C Q2A.3(C) ; also sheet 4
NACI02: D140.C Q3A.3(C) ; also sheet 4
NACI03: D141.C Q4A.3(C) ; also sheet 4
NACI04: D142.C Q5A.3(C) ; also sheet 4
NACI05: D143.C Q6A.3(C) ; also sheet 4
NACI06: D144.C Q7A.3(C) ; also sheet 4
NACI07: D145.C Q8A.3(C) ; also sheet 4
NACI08: D146.C Q9A.3(C) ; also sheet 4
NACI09: D147.C Q10A.3(C) ; also sheet 4
NACI10: D148.C Q11A.3(C) ; also sheet 4
NACI11: D149.C Q12A.3(C) ; also sheet 4
NCLRRQ: D152.C Q52.3(C) ; also sheet 4
NINTRQ: D151.C Q51.3(C) ; also sheet 4
NSKPRQ: D150.C Q50.3(C) ; also sheet 4
VCC: D153.C D155.C D157.C D159.C D161.C D163.C D165.C D167.C D169.C D171.C D173.C D175.C D177.C D179.C D181.C D183.C R41.2 R63.2 R64.2 R85.2 R86.2 R87.2 R88.2 R89.2 R90.2 R91.2 R92.2 R93.2 R94.2 R95.2 R96.2 R154.2 ; also sheet 1,2,4
Unconnected: E4.5(C:I) E4.6(C:O) E4.8(D:O) E4.9(D:I)

### Notes on the sheet
- BUGBUG: Polarity incorrect here, except BRUN.
- INPUT Connections
- Negative I/O Bus Converter

## Sheet 4 of 4
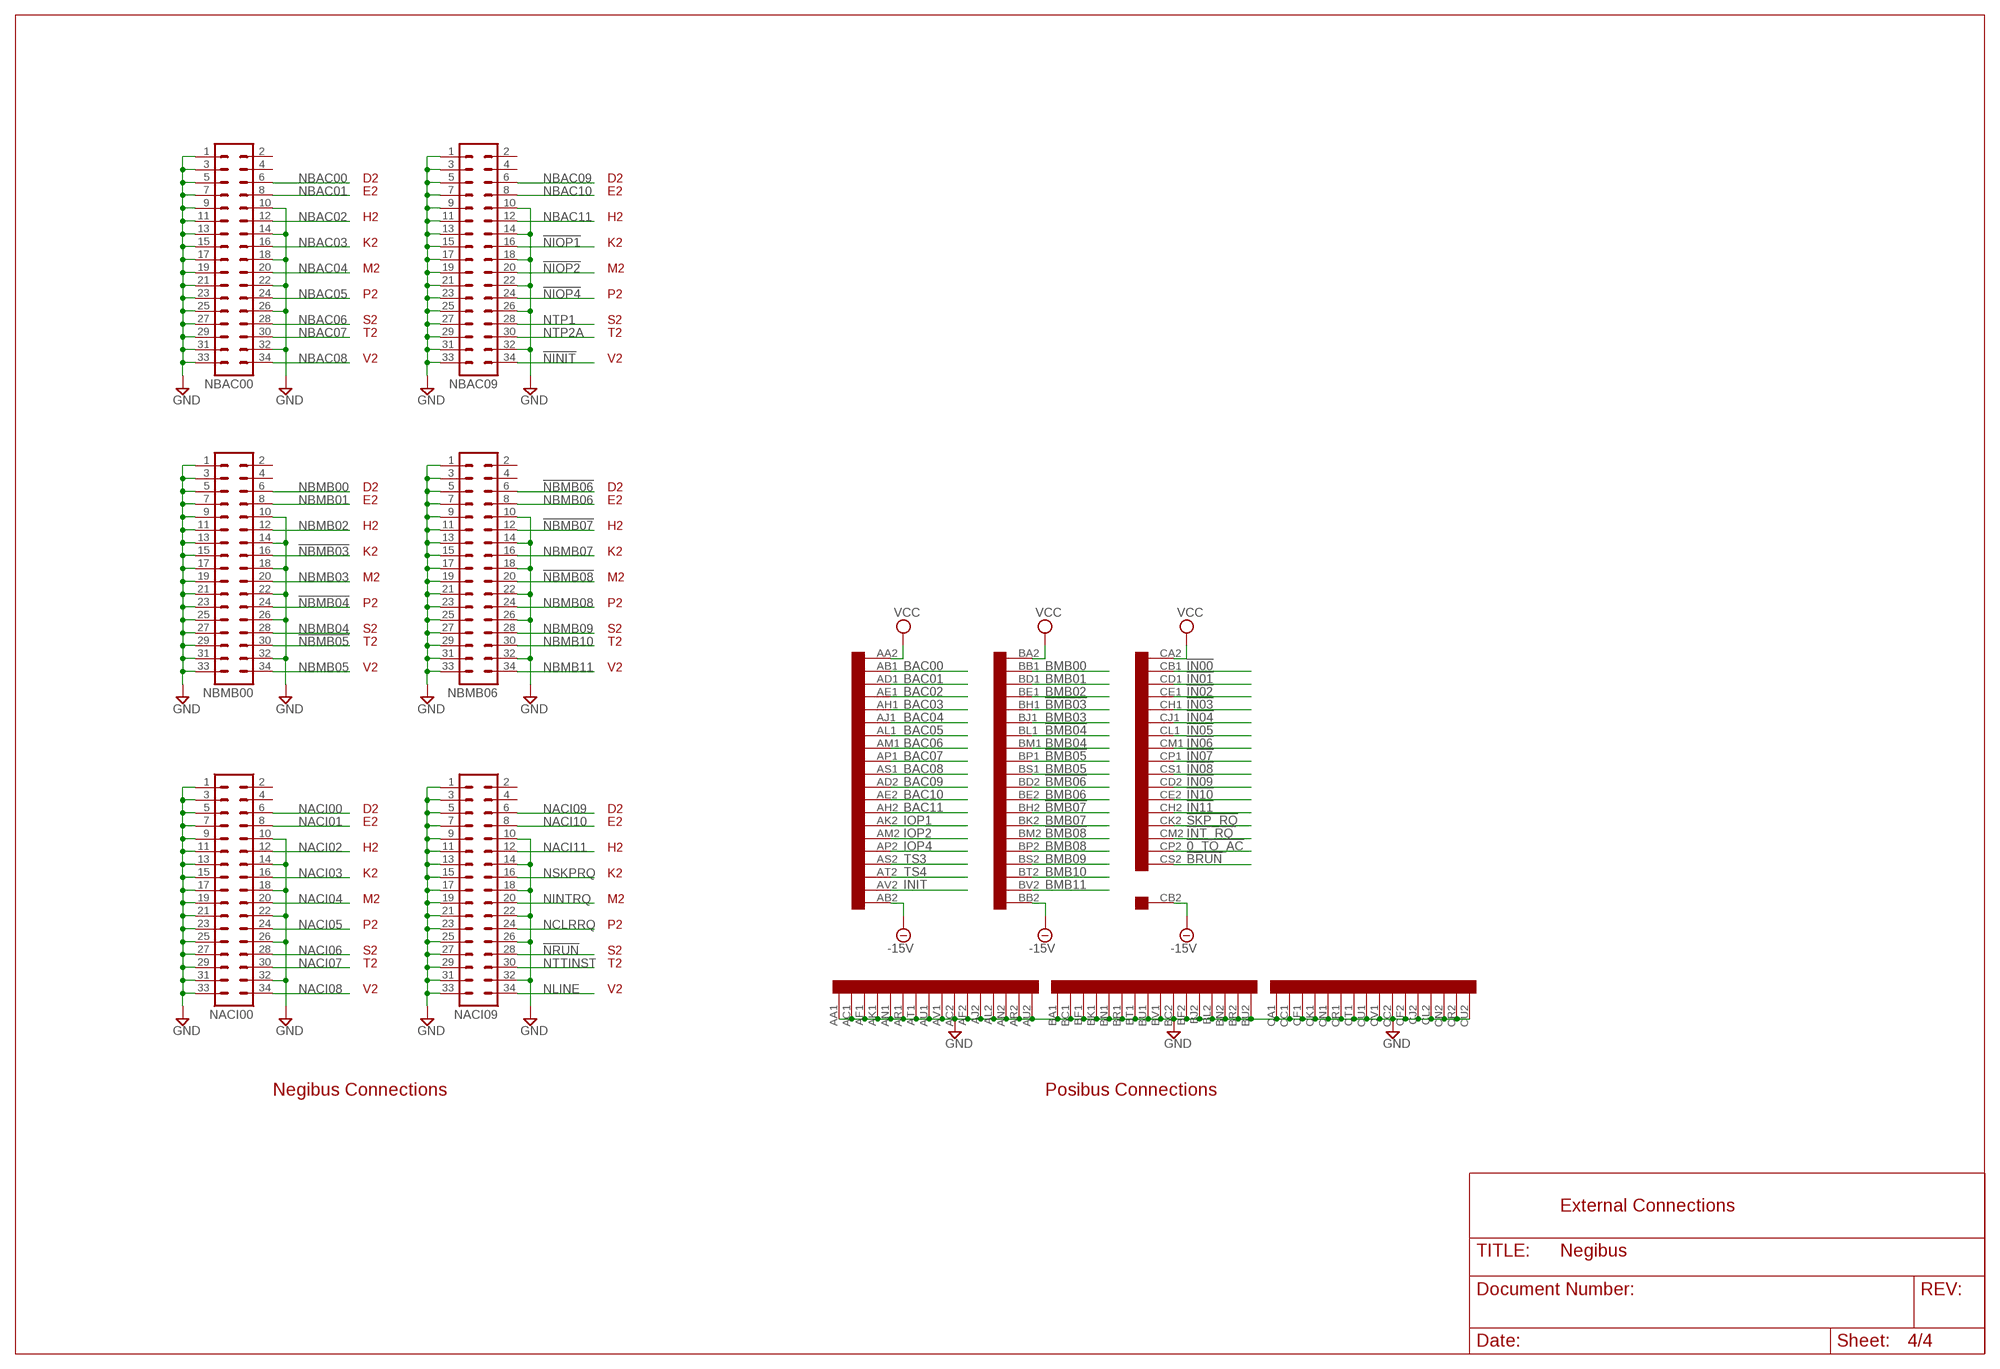
[diagram p3: schematic, sheet 4]

### Parts
NACI00  ML34L  [ML34L]
NACI09  ML34L  [ML34L]
NBAC00  ML34L  [ML34L]
NBAC09  ML34L  [ML34L]
NBMB00  ML34L  [ML34L]
NBMB06  ML34L  [ML34L]
U$3  QUAD  [EDGE-CON8]

### Nets
!0_TO_AC: U$3.CP2 ; also sheet 3
!BMB03: U$3.BH1 ; also sheet 2
!BMB04: U$3.BL1 ; also sheet 2
!BMB05: U$3.BP1 ; also sheet 2
!BMB06: U$3.BD2 ; also sheet 2
!BMB07: U$3.BH2 ; also sheet 2
!BMB08: U$3.BM2 ; also sheet 2
!BRUN: U$3.CS2 ; also sheet 3
!IN00: U$3.CB1 ; also sheet 3
!IN01: U$3.CD1 ; also sheet 3
!IN02: U$3.CE1 ; also sheet 3
!IN03: U$3.CH1 ; also sheet 3
!IN04: U$3.CJ1 ; also sheet 3
!IN05: U$3.CL1 ; also sheet 3
!IN06: U$3.CM1 ; also sheet 3
!IN07: U$3.CP1 ; also sheet 3
!IN08: U$3.CS1 ; also sheet 3
!IN09: U$3.CD2 ; also sheet 3
!IN10: U$3.CE2 ; also sheet 3
!IN11: U$3.CH2 ; also sheet 3
!INT_RQ: U$3.CM2 ; also sheet 3
!NBMB03: NBMB00.16
!NBMB04: NBMB00.24
!NBMB05: NBMB00.30
!NBMB06: NBMB06.6
!NBMB07: NBMB06.12
!NBMB08: NBMB06.20
!NINIT: NBAC09.34 ; also sheet 1
!NIOP1: NBAC09.16 ; also sheet 1
!NIOP2: NBAC09.20 ; also sheet 1
!NIOP4: NBAC09.24 ; also sheet 1
!NRUN: NACI09.28 ; also sheet 3
!SKP_RQ: U$3.CK2 ; also sheet 3
-15V: U$3.AB2 U$3.BB2 U$3.CB2 ; also sheet 2,3
BAC00: U$3.AB1 ; also sheet 1
BAC01: U$3.AD1 ; also sheet 1
BAC02: U$3.AE1 ; also sheet 1
BAC03: U$3.AH1 ; also sheet 1
BAC04: U$3.AJ1 ; also sheet 1
BAC05: U$3.AL1 ; also sheet 1
BAC06: U$3.AM1 ; also sheet 1
BAC07: U$3.AP1 ; also sheet 1
BAC08: U$3.AS1 ; also sheet 1
BAC09: U$3.AD2 ; also sheet 1
BAC10: U$3.AE2 ; also sheet 1
BAC11: U$3.AH2 ; also sheet 1
BMB00: U$3.BB1 ; also sheet 2
BMB01: U$3.BD1 ; also sheet 2
BMB02: U$3.BE1 ; also sheet 2
BMB03: U$3.BJ1 ; also sheet 2
BMB04: U$3.BM1 ; also sheet 2
BMB05: U$3.BS1 ; also sheet 2
BMB06: U$3.BE2 ; also sheet 2
BMB07: U$3.BK2 ; also sheet 2
BMB08: U$3.BP2 ; also sheet 2
BMB09: U$3.BS2 ; also sheet 2
BMB10: U$3.BT2 ; also sheet 2
BMB11: U$3.BV2 ; also sheet 2
GND: NACI00.1 NACI00.3 NACI00.5 NACI00.7 NACI00.9 NACI00.10 NACI00.11 NACI00.13 NACI00.14 NACI00.15 NACI00.17 NACI00.18 NACI00.19 NACI00.21 NACI00.22 NACI00.23 NACI00.25 NACI00.26 NACI00.27 NACI00.29 NACI00.31 NACI00.32 NACI00.33 NACI09.1 NACI09.3 NACI09.5 NACI09.7 NACI09.9 NACI09.10 NACI09.11 NACI09.13 NACI09.14 NACI09.15 NACI09.17 NACI09.18 NACI09.19 NACI09.21 NACI09.22 NACI09.23 NACI09.25 NACI09.26 NACI09.27 NACI09.29 NACI09.31 NACI09.32 NACI09.33 NBAC00.1 NBAC00.3 NBAC00.5 NBAC00.7 NBAC00.9 NBAC00.10 NBAC00.11 NBAC00.13 NBAC00.14 NBAC00.15 NBAC00.17 NBAC00.18 NBAC00.19 NBAC00.21 NBAC00.22 NBAC00.23 NBAC00.25 NBAC00.26 NBAC00.27 NBAC00.29 NBAC00.31 NBAC00.32 NBAC00.33 NBAC09.1 NBAC09.3 NBAC09.5 NBAC09.7 NBAC09.9 NBAC09.10 NBAC09.11 NBAC09.13 NBAC09.14 NBAC09.15 NBAC09.17 NBAC09.18 NBAC09.19 NBAC09.21 NBAC09.22 NBAC09.23 NBAC09.25 NBAC09.26 NBAC09.27 NBAC09.29 NBAC09.31 NBAC09.32 NBAC09.33 NBMB00.1 NBMB00.3 NBMB00.5 NBMB00.7 NBMB00.9 NBMB00.10 NBMB00.11 NBMB00.13 NBMB00.14 NBMB00.15 NBMB00.17 NBMB00.18 NBMB00.19 NBMB00.21 NBMB00.22 NBMB00.23 NBMB00.25 NBMB00.26 NBMB00.27 NBMB00.29 NBMB00.31 NBMB00.32 NBMB00.33 NBMB06.1 NBMB06.3 NBMB06.5 NBMB06.7 NBMB06.9 NBMB06.10 NBMB06.11 NBMB06.13 NBMB06.14 NBMB06.15 NBMB06.17 NBMB06.18 NBMB06.19 NBMB06.21 NBMB06.22 NBMB06.23 NBMB06.25 NBMB06.26 NBMB06.27 NBMB06.29 NBMB06.31 NBMB06.32 NBMB06.33 U$3.AA1 U$3.AC1 U$3.AC2 U$3.AF1 U$3.AF2 U$3.AJ2 U$3.AK1 U$3.AL2 U$3.AN1 U$3.AN2 U$3.AR1 U$3.AR2 U$3.AT1 U$3.AU1 U$3.AU2 U$3.AV1 U$3.BA1 U$3.BC1 U$3.BC2 U$3.BF1 U$3.BF2 U$3.BJ2 U$3.BK1 U$3.BL2 U$3.BN1 U$3.BN2 U$3.BR1 U$3.BR2 U$3.BT1 U$3.BU1 U$3.BU2 U$3.BV1 U$3.CA1 U$3.CC1 U$3.CC2 U$3.CF1 U$3.CF2 U$3.CJ2 U$3.CK1 U$3.CL2 U$3.CN1 U$3.CN2 U$3.CR1 U$3.CR2 U$3.CT1 U$3.CU1 U$3.CU2 U$3.CV1 ; also sheet 1,2,3
INIT: U$3.AV2 ; also sheet 1
IOP1: U$3.AK2 ; also sheet 1
IOP2: U$3.AM2 ; also sheet 1
IOP4: U$3.AP2 ; also sheet 1
NACI00: NACI00.6 ; also sheet 3
NACI01: NACI00.8 ; also sheet 3
NACI02: NACI00.12 ; also sheet 3
NACI03: NACI00.16 ; also sheet 3
NACI04: NACI00.20 ; also sheet 3
NACI05: NACI00.24 ; also sheet 3
NACI06: NACI00.28 ; also sheet 3
NACI07: NACI00.30 ; also sheet 3
NACI08: NACI00.34 ; also sheet 3
NACI09: NACI09.6 ; also sheet 3
NACI10: NACI09.8 ; also sheet 3
NACI11: NACI09.12 ; also sheet 3
NBAC00: NBAC00.6 ; also sheet 1
NBAC01: NBAC00.8 ; also sheet 1
NBAC02: NBAC00.12 ; also sheet 1
NBAC03: NBAC00.16 ; also sheet 1
NBAC04: NBAC00.20 ; also sheet 1
NBAC05: NBAC00.24 ; also sheet 1
NBAC06: NBAC00.28 ; also sheet 1
NBAC07: NBAC00.30 ; also sheet 1
NBAC08: NBAC00.34 ; also sheet 1
NBAC09: NBAC09.6 ; also sheet 1
NBAC10: NBAC09.8 ; also sheet 1
NBAC11: NBAC09.12 ; also sheet 1
NBMB00: NBMB00.6 ; also sheet 2
NBMB01: NBMB00.8 ; also sheet 2
NBMB02: NBMB00.12 ; also sheet 2
NBMB03: NBMB00.20 ; also sheet 2
NBMB04: NBMB00.28 ; also sheet 2
NBMB05: NBMB00.34 ; also sheet 2
NBMB06: NBMB06.8 ; also sheet 2
NBMB07: NBMB06.16 ; also sheet 2
NBMB08: NBMB06.24 ; also sheet 2
NBMB09: NBMB06.28 ; also sheet 2
NBMB10: NBMB06.30 ; also sheet 2
NBMB11: NBMB06.34 ; also sheet 2
NCLRRQ: NACI09.24 ; also sheet 3
NINTRQ: NACI09.20 ; also sheet 3
NLINE: NACI09.34
NSKPRQ: NACI09.16 ; also sheet 3
NTP1: NBAC09.28 ; also sheet 1
NTP2A: NBAC09.30 ; also sheet 1
NTTINST: NACI09.30
TS3: U$3.AS2 ; also sheet 1
TS4: U$3.AT2 ; also sheet 1
VCC: U$3.AA2 U$3.BA2 U$3.CA2 ; also sheet 1,2,3
Unconnected: NACI00.2 NACI00.4 NACI09.2 NACI09.4 NBAC00.2 NBAC00.4 NBAC09.2 NBAC09.4 NBMB00.2 NBMB00.4 NBMB06.2 NBMB06.4 U$3.CT2 U$3.CV2 U$3.DA1 U$3.DA2 U$3.DB1 U$3.DB2 U$3.DC1 U$3.DC2 U$3.DD1 U$3.DD2 U$3.DE1 U$3.DE2 U$3.DF1 U$3.DF2 U$3.DH1 U$3.DH2 U$3.DJ1 U$3.DJ2 U$3.DK1 U$3.DK2 U$3.DL1 U$3.DL2 U$3.DM1 U$3.DM2 U$3.DN1 U$3.DN2 U$3.DP1 U$3.DP2 U$3.DR1 U$3.DR2 U$3.DS1 U$3.DS2 U$3.DT1 U$3.DT2 U$3.DU1 U$3.DU2 U$3.DV1 U$3.DV2

### Notes on the sheet
- D2 | D2
- E2 | E2
- H2 | H2
- K2 | K2
- M2 | M2
- P2 | P2
- S2 | S2
- T2 | T2
- V2 | V2
- D2 | D2
- E2 | E2
- H2 | H2
- K2 | K2
- M2 | M2
- P2 | P2
- S2 | S2
- T2 | T2
- V2 | V2
- D2 | D2
- E2 | E2
- H2 | H2
- K2 | K2
- M2 | M2
- P2 | P2
- S2 | S2
- T2 | T2
- V2 | V2
- Negibus Connections | Posibus Connections
- External Connections

## Power pins joined to a net without a drawn wire
GND: E1.7(P:GND) E2.7(P:GND) E4.7(P:GND) E13.7(P:GND) E14.7(P:GND) E17.7(P:GND) E18.7(P:GND) E21.7(P:GND) E22.7(P:GND) E27.7(P:GND) E48.7(P:GND) E49.7(P:GND)
VCC: E1.14(P:VCC) E2.14(P:VCC) E4.14(P:VCC) E13.14(P:VCC) E14.14(P:VCC) E17.14(P:VCC) E18.14(P:VCC) E21.14(P:VCC) E22.14(P:VCC) E27.14(P:VCC) E48.14(P:VCC) E49.14(P:VCC)

## Library data of the parts
C1-C16 C23-C31 C33-C42 = rcl:C-US: CAPACITOR, American symbol
C20-C22 = dec-con:CPOL-USE20-8AXIAL: A 0.8 inch electrolytic.
D1 D2 D5 D8 D11 D13-D38 D40-D53 D57 D60 D63 D66 D69 D72 D75 = diode:DIODE-: DIODE
D3 D4 D6 D7 D9 D10 D12 D39 D54-D56 D58 D59 D61 D62 D64 D65 D67 D68 D70 D71 D73 D74 D76-D184 = diode:1N4148: DIODE high speed (Philips)
E1 E2 = 74xx-eu:74*07: Hex BUFFER, open collector high-voltage output
E4 E48 E49 = 74xx-us:74*04: Hex INVERTER
E13 E14 E18 E22 E27 = 74xx-us:74*07: Hex BUFFER, open collector high-voltage output
E17 E21 = 74xx-us:74*16: Hex INVERTER, open collector, high-voltage
NACI00 NACI09 NBAC00 NBAC09 NBMB00 NBMB06 = con-ml:ML34L: HARTING; OC_FARNELL: unknown; OC_NEWARK: unknown
Q1-Q6 = transistor:*-NPN-: NPN Transistror
Q1A Q2A Q3A Q4A Q5A Q6A Q7 Q7A Q8A Q9A Q10A Q11A Q12A Q50-Q52 = transistor-pnp:2N3637*: PNP Transistror
Q1B Q2B Q3B Q4B Q5B Q6B Q7B Q8B Q9B Q10B Q11B Q12B Q13B Q14B Q15B Q16B Q17B Q18B Q26-Q37 = transistor-npn:2N3019: NPN Transistor
R1-R70 R72-R160 = rcl:R-US_: RESISTOR, American symbol
U$1 = dec-con:OUTLINE-*: Board outlines for DEC boards.
U$3 = dec-con:QUAD: Quad-Height DEC board

## Net classes
1 power: width 0.813 mm